# Altium schematic sheet Battery_supply.SchDoc
size A
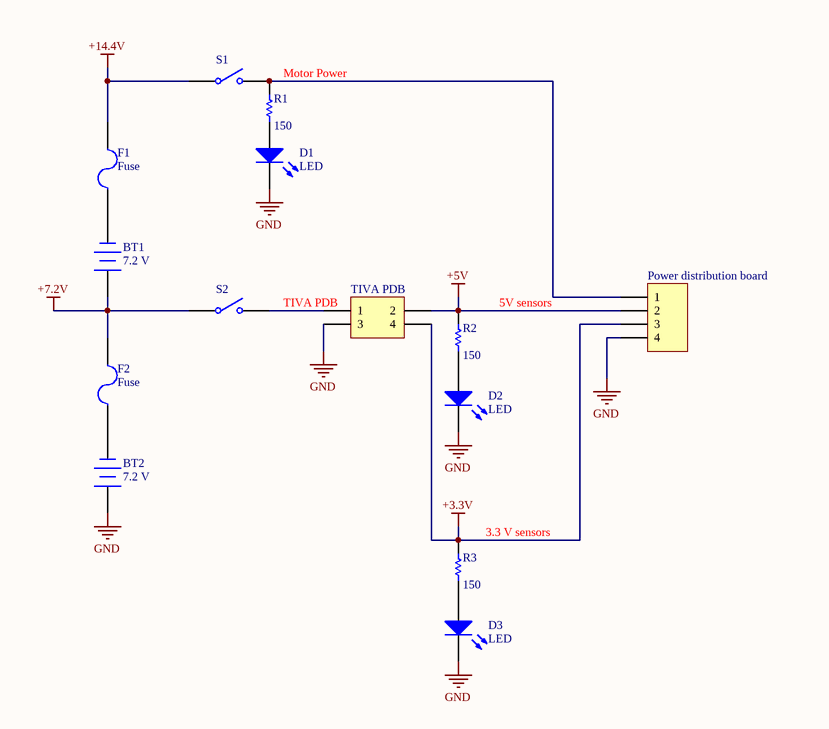
[diagram p0: Battery_supply.SchDoc]

## Parts
BT1  7.2 V  [BAT-2]
BT2  7.2 V  [BAT-2]
D1  LED  [LED-1]
D2  LED  [LED-1]
D3  LED  [LED-1]
F1  Fuse  [PIN-W2/E2.8]
F2  Fuse  [PIN-W2/E2.8]
Power_distribution_board  Header 4  [HDR1X4]  (value not drawn)
R1  value 150  [AXIAL-0.3]  (hidden comment: Res1)
R2  value 150  [AXIAL-0.3]  (hidden comment: Res1)
R3  value 150  [AXIAL-0.3]  (hidden comment: Res1)
S1  (no value)  [SPST-2]
S2  (no value)  [SPST-2]
TIVA_PDB  Header 2X2  [HDR2X2]  (value not drawn)

## Nets
+3.3V: Power_distribution_board.3 R3.2 TIVA_PDB.4
+5V: Power_distribution_board.2 R2.2 TIVA_PDB.2
+7.2V: BT1.1(+) F2.2 S2.1(COMMON)
+14.4V: F1.2 S1.1(COMMON)
GND: BT2.1(+) D1.2(K) D2.2(K) D3.2(K) Power_distribution_board.4 TIVA_PDB.3
NetBT1_2: BT1.2(-) F1.1
NetBT2_2: BT2.2(-) F2.1
NetD2_1: D2.1(A) R2.1
NetD3_1: D3.1(A) R3.1
NetPower_distribution_board_1: Power_distribution_board.1 R1.2 S1.2(NO)
NetS2_2: S2.2(NO) TIVA_PDB.1

Not connected (* = marked no-connect by the designer): D1 1(A); R1 1

## Notes on the sheet
- (near R1) Motor Power
- (near TIVA_PDB) TIVA PDB
- (near R2) 5V sensors
- (near R3) 3.3 V sensors

## Library data of the parts
BT1 BT2 = Battery: Multicell Battery; Published: 24-Mar-1999; LatestRevisionDate: 17-Jul-2002; LatestRevisionNote: Re-released for DXP Platform.; PackageReference: BAT-2; Publisher: Altium Limited; PackageDescription: Battery; 2 Leads
D1-D3 = LED1: Typical RED GaAs LED; Published: 8-Jun-2000; LatestRevisionDate: 08-Jul-2005; LatestRevisionNote: Mech Layer 1 removed.; PackageReference: LED-1; Publisher: Altium Limited; PackageDescription: LED; 2 Leads
F1 F2 = Fuse 2: Published: 8-Jun-2000; LatestRevisionDate: 17-Jul-2002; LatestRevisionNote: Re-released for DXP Platform.; PackageReference: PIN-W2/E2.8; Publisher: Altium Limited; PackageDescription: Thru-Hole; 2 Leads
Power_distribution_board = Header 4: Header, 4-Pin; LatestRevisionDate: 17-Jul-2002; LatestRevisionNote: Re-released for DXP Platform.; Publisher: Altium Limited
R1-R3 = Res1: Resistor; Published: 8-Jun-2000; LatestRevisionDate: 17-Jul-2002; LatestRevisionNote: Re-released for DXP Platform.; PackageReference: AXIAL-0.3; Publisher: Altium Limited; PackageDescription: Axial Device, Thru-Hole; 2 Leads; 0.3 in Pin Spacing
S1 S2 = SW-SPST: Single-Pole, Single-Throw Switch; Published: 24-Mar-1999; LatestRevisionDate: 17-Jul-2002; LatestRevisionNote: Re-released for DXP Platform.; PackageReference: SPST-2; Publisher: Altium Limited; PackageDescription: Switch; 2 Leads
TIVA_PDB = Header 2X2: Header, 2-Pin, Dual row; LatestRevisionDate: 17-Jul-2002; LatestRevisionNote: Re-released for DXP Platform.; Publisher: Altium Limited